# Altium project remoteV1.2.PrjPcb
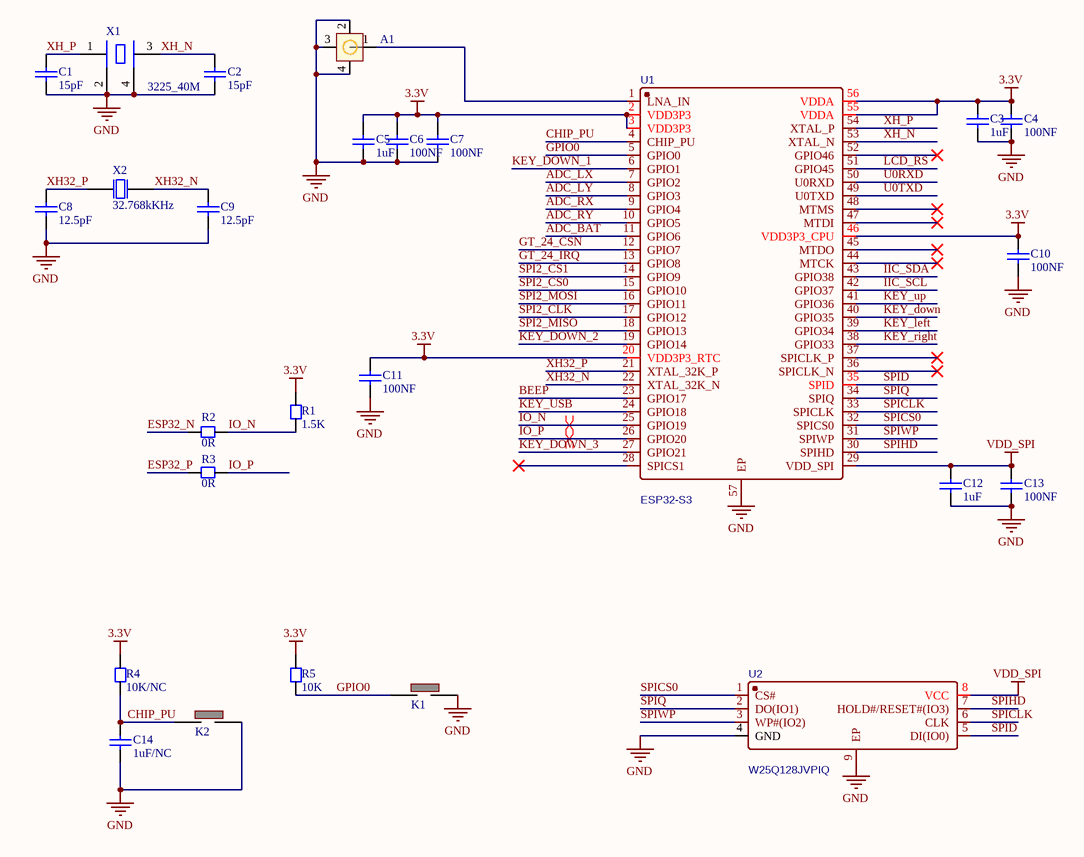
[diagram p0: Sheet0-mcu.SchDoc]
3 sheets, 124 parts. Net scope: global (net labels, ports and power ports of the same name join across sheets).
Board file: PCB.PcbDoc
Sheets:
  Sheet0-mcu.SchDoc
  Sheet1-control.SchDoc
  Sheet2-USB.SchDoc

## Sheet Sheet0-mcu.SchDoc
size A4; SheetNumber: 1; SheetTotal: 3

### Parts
A1  ANT-IPEX  [IPEX-SMD_HC-RF-IPEX0303-01]  (value not drawn)
C1  15pF  [CC1608-0603]
C2  15pF  [CC1608-0603]
C3  1uF  [CC1608-0603]
C4  100NF  [CC1608-0603]
C5  1uF  [CC1608-0603]
C6  100NF  [CC1608-0603]
C7  100NF  [CC1608-0603]
C8  12.5pF  [CC1608-0603]
C9  12.5pF  [CC1608-0603]
C10  100NF  [CC1608-0603]
C11  100NF  [CC1608-0603]
C12  1uF  [CC1608-0603]
C13  100NF  [CC1608-0603]
C14  1uF/NC  [CC1608-0603]
K1  KEY 3*4  [KEY 3*4]  (value not drawn)
K2  KEY 3*4  [KEY 3*4]  (value not drawn)
R1  1.5K  [CR1608-0603]
R2  0R  [CR1608-0603]
R3  0R  [CR1608-0603]
R4  10K/NC  [CR1608-0603]
R5  10K  [CR1608-0603]
U1  ESP32-S3  [QFN-56]
U2  W25Q128JVPIQ  [WSON-8]
X1  3225_40M  [XTAL-3225]
X2  32.768kKHz  [XTAL-3215]

### Nets
3.3V: C3.2 C4.2 C5.2 C6.2 C7.2 C10.2 C11.2 R1.1 R4.2 R5.2 U1.2(VDD3P3) U1.3(VDD3P3) U1.20(VDD3P3_RTC) U1.46(VDD3P3_CPU) U1.55(VDDA) U1.56(VDDA)
GND: A1.2 A1.3 A1.4 C1.1 C2.1 C3.1 C4.1 C5.1 C6.1 C7.1 C8.1 C9.1 C10.1 C11.1 C12.1 C13.1 C14.1 K1.2 K2.2 U1.57(EP) U2.4(GND) U2.9(EP) X1.2(GND) X1.4(GND)
VDD_SPI: C12.2 C13.2 U1.29(VDD_SPI) U2.8(VCC)
ADC_BAT: U1.11(GPIO6)
ADC_LX: U1.7(GPIO2)
ADC_LY: U1.8(GPIO3)
ADC_RX: U1.9(GPIO4)
ADC_RY: U1.10(GPIO5)
BEEP: U1.23(GPIO17)
CHIP_PU: C14.2 K2.1 R4.1 U1.4(CHIP_PU)
ESP32_N: R2.2
ESP32_P: R3.2
GPIO0: K1.1 R5.1 U1.5(GPIO0)
GT_24_CSN: U1.12(GPIO7)
GT_24_IRQ: U1.13(GPIO8)
IIC_SCL: U1.42(GPIO37)
IIC_SDA: U1.43(GPIO38)
IO_N: R1.2 R2.1 U1.25(GPIO19)
IO_P: R3.1 U1.26(GPIO20)
KEY_down: U1.40(GPIO35)  [project net KEY_b]
KEY_DOWN_1: U1.6(GPIO1)
KEY_DOWN_2: U1.19(GPIO14)
KEY_DOWN_3: U1.27(GPIO21)
KEY_left: U1.39(GPIO34)
KEY_right: U1.38(GPIO33)  [project net KET_y]
KEY_up: U1.41(GPIO36)  [project net KEY_a]
KEY_USB: U1.24(GPIO18)
LCD_RS: U1.51(GPIO45)
SPI2_CLK: U1.17(GPIO12)
SPI2_CS0: U1.15(GPIO10)
SPI2_CS1: U1.14(GPIO9)
SPI2_MISO: U1.18(GPIO13)
SPI2_MOSI: U1.16(GPIO11)
SPICLK: U1.33(SPICLK) U2.6(CLK)
SPICS0: U1.32(SPICS0) U2.1(CS#)
SPID: U1.35(SPID) U2.5(DI(IO0))
SPIHD: U1.30(SPIHD) U2.7(HOLD#/RESET#(IO3))
SPIQ: U1.34(SPIQ) U2.2(DO(IO1))
SPIWP: U1.31(SPIWP) U2.3(WP#(IO2))
U0RXD: U1.50(U0RXD)
U0TXD: U1.49(U0TXD)
XH32_N: C9.2 U1.22(XTAL_32K_N) X2.2(OSC2)
XH32_P: C8.2 U1.21(XTAL_32K_P) X2.1(OSC1)
XH_N: C2.2 U1.53(XTAL_N) X1.3(OSC2)
XH_P: C1.2 U1.54(XTAL_P) X1.1(OSC1)
NetA1_1: A1.1 U1.1(LNA_IN)

Not connected (* = marked no-connect by the designer): U1 28(SPICS1)* 36(SPICLK_N)* 37(SPICLK_P)* 44(MTCK)* 45(MTDO)* 47(MTDI)* 48(MTMS)* 52(GPIO46)*

### Layout directives
differential pair: IO_N, IO_P

### Library data of the parts
A1 = ANT-IPEX: 贴片封装的天线 封装类型为IPEX
C1-C14 = Cap Chip 0603: 0603封装的电容; Published: 8-Jun-2000; Revision: July-2002: Re-released for DXP Platform.; Publisher: Altium Limited
K1 K2 = KEY 3*4: 轻触开关按键
R1-R5 = Resistor Chip 0603: 0603封装电阻; Published: 8-Jun-2000; Revision: July-2002: Re-released for DXP Platform.; Publisher: Altium Limited
U1 = ESP32-S3: Manufacturer: ESPRESSIF(乐鑫); Contributor: LCSC; Supplier: LCSC; Supplier Part: C2913192; Manufacturer Part: ESP32-S3; JLCPCB Part Class: Extended Part; spicePre: U; spiceSymbolName: ESP32-S3
U2 = W25Q128JVPIQ: Manufacturer: WINBOND(华邦); Contributor: LCSC; Supplier: LCSC; Supplier Part: C2803379; Manufacturer Part: W25Q128JVPIQ; JLCPCB Part Class: Extended Part; spicePre: U; spiceSymbolName: W25Q128JVPIQ
X1 = XTAL 3225: 3225封装的晶振
X2 = XTAL 3215 32.768kKHz: 3215封装的时钟晶振

## Sheet Sheet1-control.SchDoc
size A3; SheetNumber: 2; SheetTotal: 3
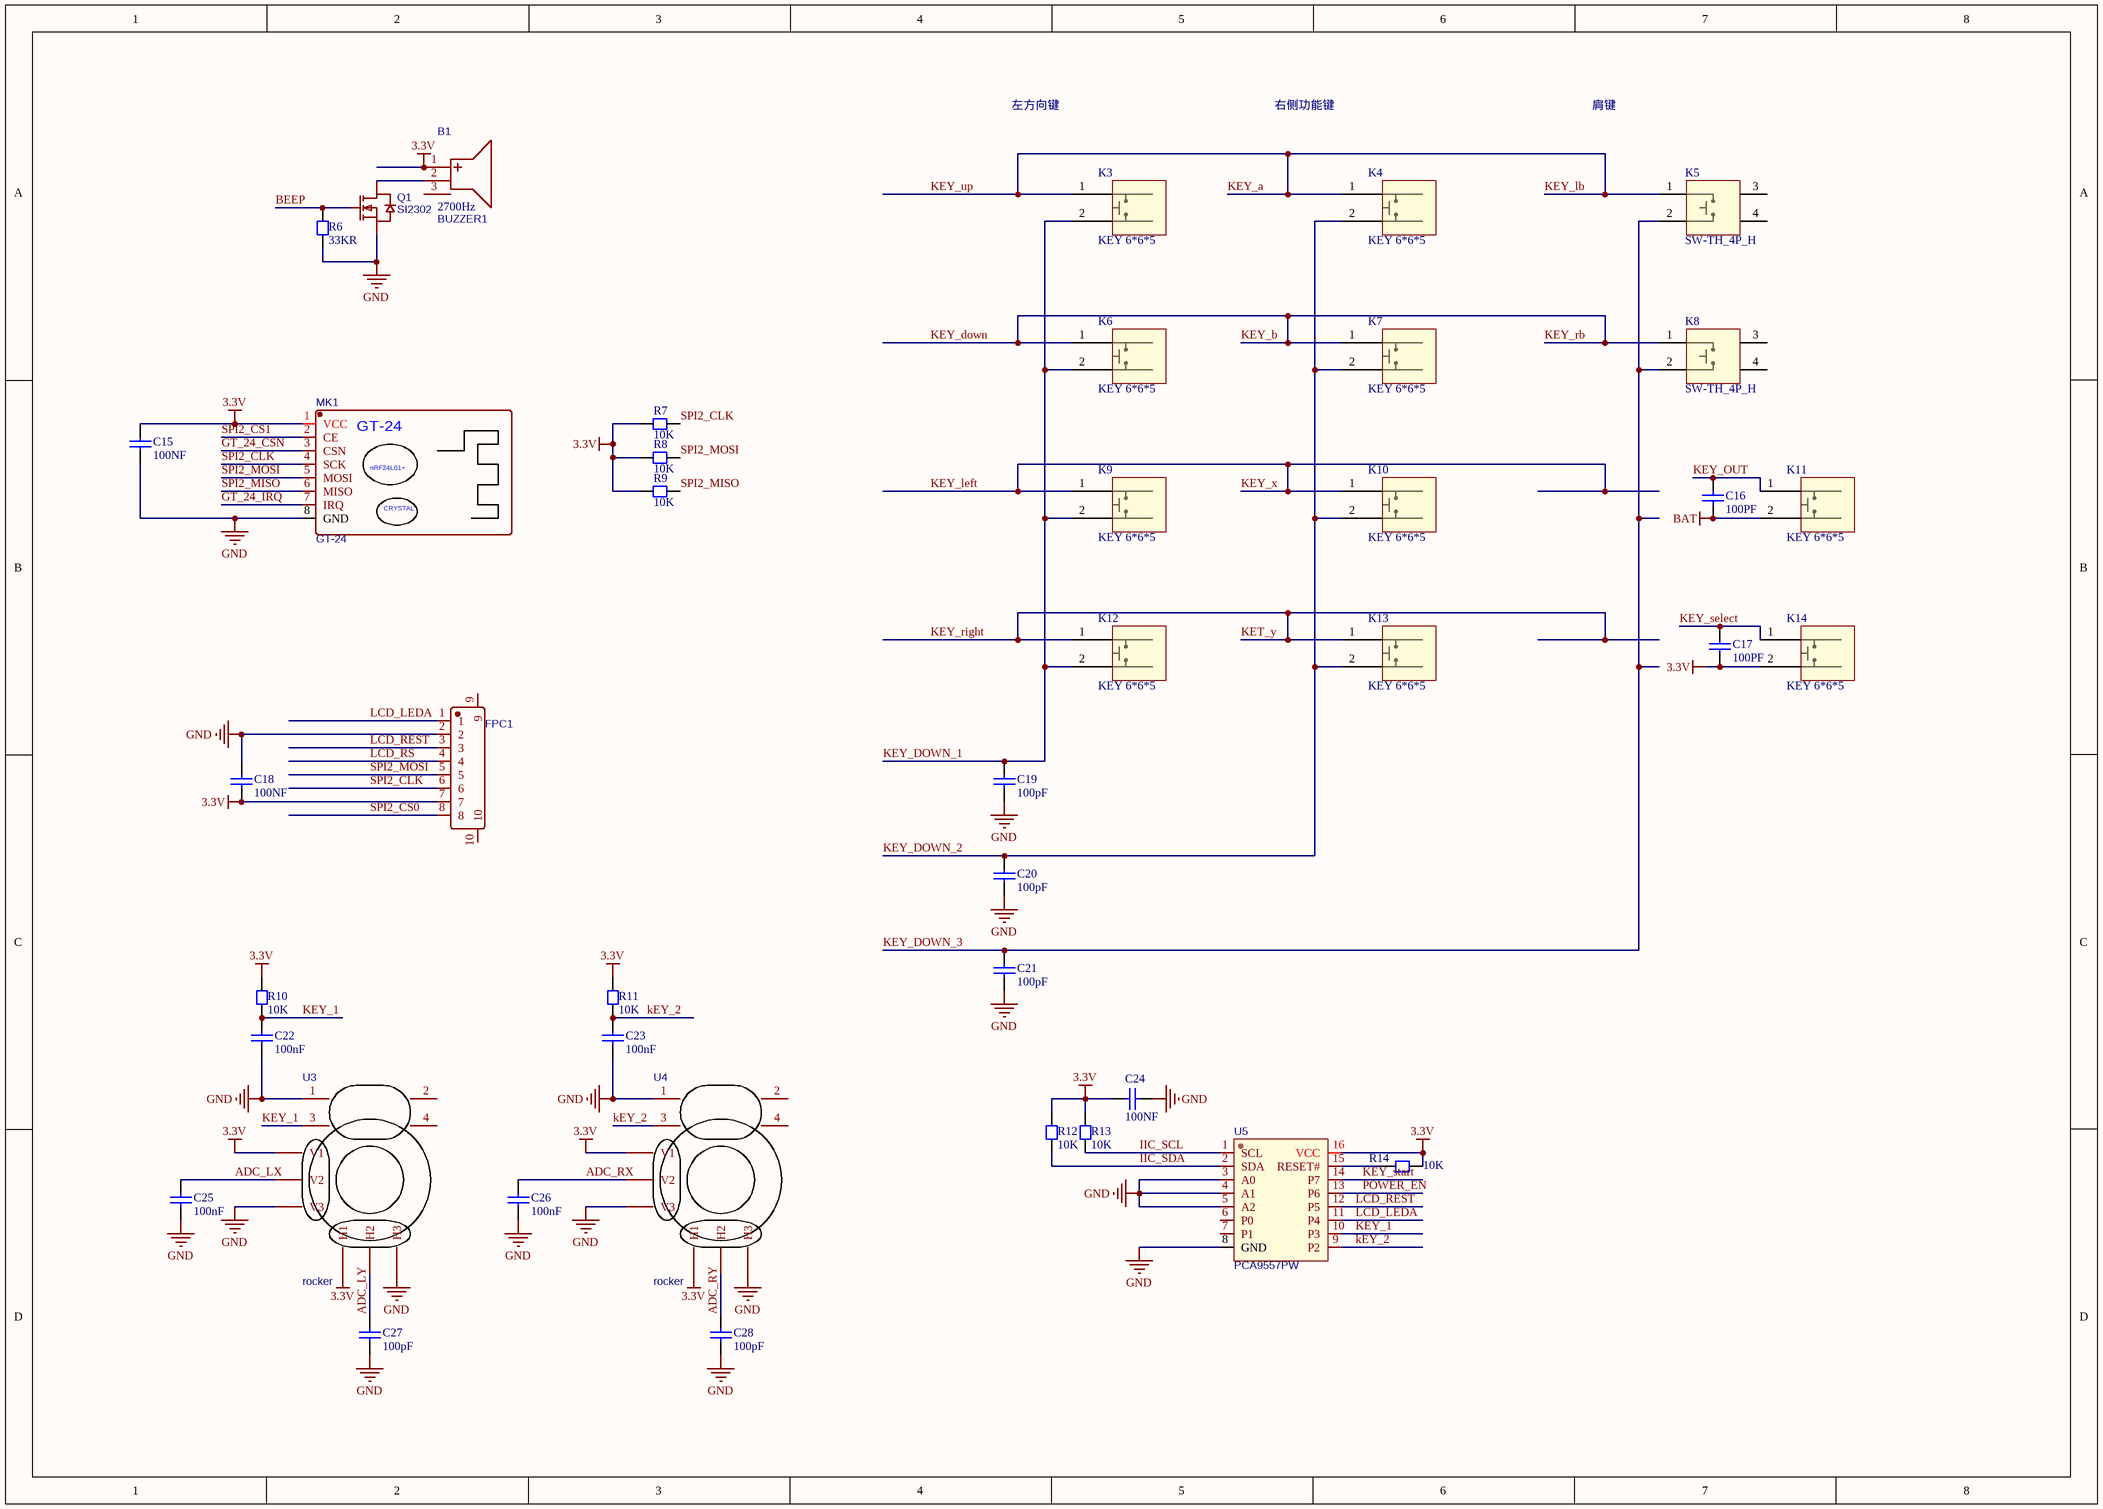
[diagram p1: Sheet1-control.SchDoc]

### Parts
B1  BUZZER1  [BUZ-SMD_GSC7525RA]
C15  100NF  [CC1608-0603]
C16  100PF  [CC1608-0603]
C17  100PF  [CC1608-0603]
C18  100NF  [CC1608-0603]
C19  100pF  [CC1608-0603]
C20  100pF  [CC1608-0603]
C21  100pF  [CC1608-0603]
C22  100nF  [CC1608-0603]
C23  100nF  [CC1608-0603]
C24  100NF  [CC1608-0603]
C25  100nF  [CC1608-0603]
C26  100nF  [CC1608-0603]
C27  100pF  [CC1608-0603]
C28  100pF  [CC1608-0603]
FPC1  FFC 05 8P  [FFC-SMD_8P-P0.50]  (value not drawn)
K3  KEY 6*6*5  [KEY 6*6*5]
K4  KEY 6*6*5  [KEY 6*6*5]
K5  SW-TH_4P_H  [SW-TH_KH-6X6X7H-ZJ]
K6  KEY 6*6*5  [KEY 6*6*5]
K7  KEY 6*6*5  [KEY 6*6*5]
K8  SW-TH_4P_H  [SW-TH_KH-6X6X7H-ZJ]
K9  KEY 6*6*5  [KEY 6*6*5]
K10  KEY 6*6*5  [KEY 6*6*5]
K11  KEY 6*6*5  [KEY 6*6*5]
K12  KEY 6*6*5  [KEY 6*6*5]
K13  KEY 6*6*5  [KEY 6*6*5]
K14  KEY 6*6*5  [KEY 6*6*5]
MK1  GT-24  [WIRELM-SMD_AS01-ML01S]
Q1  SI2302  [SOT-23]
R6  33KR  [CR1608-0603]
R7  10K  [CR1608-0603]
R8  10K  [CR1608-0603]
R9  10K  [CR1608-0603]
R10  10K  [CR1608-0603]
R11  10K  [CR1608-0603]
R12  10K  [CR1608-0603]
R13  10K  [CR1608-0603]
R14  10K  [CR1608-0603]
U3  rocker  [PCBComponent_1]
U4  rocker  [PCBComponent_1]
U5  PCA9557PW  [TSSOP-16]

### Nets
3.3V: B1.1(+) C15.2 C17.2 C18.1 C24.2 FPC1.7 K14.2 MK1.1(VCC) R7.2 R8.2 R9.2 R10.2 R11.2 R12.1 R13.1 R14.1 U3.5(V1) U3.8(H1) U4.5(V1) U4.8(H1) U5.16(VCC)
BAT: C16.2 K11.2
GND: C15.1 C18.2 C19.1 C20.1 C21.1 C22.1 C23.1 C24.1 C25.1 C26.1 C27.1 C28.1 FPC1.2 MK1.8(GND) Q1.2(S) R6.2 U3.1 U3.7(V3) U3.10(H3) U4.1 U4.7(V3) U4.10(H3) U5.3(A0) U5.4(A1) U5.5(A2) U5.8(GND)
ADC_LX: C25.2 U3.6(V2)
ADC_LY: C27.2 U3.9(H2)
ADC_RX: C26.2 U4.6(V2)
ADC_RY: C28.2 U4.9(H2)
BEEP: Q1.1(G) R6.1
GT_24_CSN: MK1.3(CSN)
GT_24_IRQ: MK1.7(IRQ)
IIC_SCL: R13.2 U5.1(SCL)
IIC_SDA: R12.2 U5.2(SDA)
KET_y: K12.1 K13.1  [also labelled KEY_right]
KEY_1: C22.2 R10.1 U3.3 U5.10(P3)
kEY_2: C23.2 R11.1 U4.3 U5.9(P2)
KEY_a: K3.1 K4.1 K5.1  [also labelled KEY_lb, KEY_up]
KEY_b: K6.1 K7.1 K8.1  [also labelled KEY_down, KEY_rb]
KEY_DOWN_1: C19.2 K3.2 K6.2 K9.2 K12.2
KEY_DOWN_2: C20.2 K4.2 K7.2 K10.2 K13.2
KEY_DOWN_3: C21.2 K5.2 K8.2
KEY_left: K9.1 K10.1  [also labelled KEY_x]
KEY_OUT: C16.1 K11.1
KEY_select: C17.1 K14.1
KEY_start: U5.14(P7)
LCD_LEDA: FPC1.1 U5.11(P4)
LCD_REST: FPC1.3 U5.12(P5)
LCD_RS: FPC1.4
POWER_EN: U5.13(P6)
SPI2_CLK: FPC1.6 MK1.4(SCK) R7.1
SPI2_CS0: FPC1.8
SPI2_CS1: MK1.2(CE)
SPI2_MISO: MK1.6(MISO) R9.1
SPI2_MOSI: FPC1.5 MK1.5(MOSI) R8.1
NetB1_2: B1.2(-) Q1.3(D)
NetR14_2: R14.2 U5.15(RESET#)

Not connected (* = marked no-connect by the designer): B1 3(EH); FPC1 9 10; K5 3 4; K8 3 4; U3 2 4; U4 2 4; U5 6(P0) 7(P1)

### Notes on the sheet
- 左方向键
- 右侧功能键
- 肩键
- (in symbol GT-24) nRF24L01+; CRYSTAL

### Library data of the parts
B1 = BUZZER1: 2700Hz; Manufacturer: INGHAi(赢海); Manufacturer Part: GSC7525RA-16R2700; Contributor: LCSC; nameAlias: Value; Supplier: LCSC; Supplier Part: C255313; spicePre: B; spiceSymbolName: GSC7525RA-16R2700
C15-C28 = Cap Chip 0603: 0603封装的电容; Published: 8-Jun-2000; Revision: July-2002: Re-released for DXP Platform.; Publisher: Altium Limited
FPC1 = FFC 05 8P: Manufacturer: TXGA(特思嘉); Manufacturer Part: FFC05001-08SBB124W5M-H; Contributor: LCSC; Supplier: LCSC; Supplier Part: C456420; JLCPCB Part Class: Extended Part; spicePre: F; spiceSymbolName: FFC05001-08SBB124W5M-H
K3 K4 K6 K7 K9-K14 = KEY 6*6*5: 无声轻触开关
K5 K8 = SW-TH_4P_H: 卧式轻触开关
MK1 = GT-24: 工业级GT-24数传无线模块 2.4G NRF24L01&PA+LNA; Manufacturer: Ashining(泽耀科技); Manufacturer Part: AS01-ML01S; Supplier: LCSC; Supplier Part: C84802; JLCPCB Part Class: Extended Part; spicePre: M; spiceSymbolName: AS01-ML01S
Q1 = SI2302: N沟道 / 漏源电压(Vdss) 20V / 连续漏极电流(Id) 2.8A / 功率(Pd) 900mW / 导通电阻(RDS(on)@Vgs,Id) 55mΩ@4.5V,2.8A / 阈值电压(Vgs(th)@Id) 1.2V@250uA / 输入电容(Ciss@Vds) 260pF@10V; Manufacturer: TWGMC(台湾迪嘉); Manufacturer Part: SI2306; Contributor: LCSC; Supplier: LCSC; Supplier Part: C727154; JLCPCB Part Class: Extended Part; spicePre: Q; spiceSymbolName: SI2306_C727154
R6 = Chip resistor: 贴片电阻
R7-R14 = Resistor Chip 0603: 0603封装电阻; Published: 8-Jun-2000; Revision: July-2002: Re-released for DXP Platform.; Publisher: Altium Limited
U3 U4 = rocker: Manufacturer Part: 摇杆; Contributor: Alex_Ai; spicePre: U; spiceSymbolName: 摇杆_直插_圆半径13_10电气脚_4固定脚 COPY
U5 = PCA9557PW: TSSOP-16 8位I2C总线和SMBus I/O扩展器芯片; Manufacturer: TI(德州仪器); Contributor: LCSC; Supplier: LCSC; Supplier Part: C1542488; Manufacturer Part: PCA9557PW; JLCPCB Part Class: Extended Part; spicePre: U; spiceSymbolName: PCA9557PW

## Sheet Sheet2-USB.SchDoc
size A3; SheetNumber: 3; SheetTotal: 3
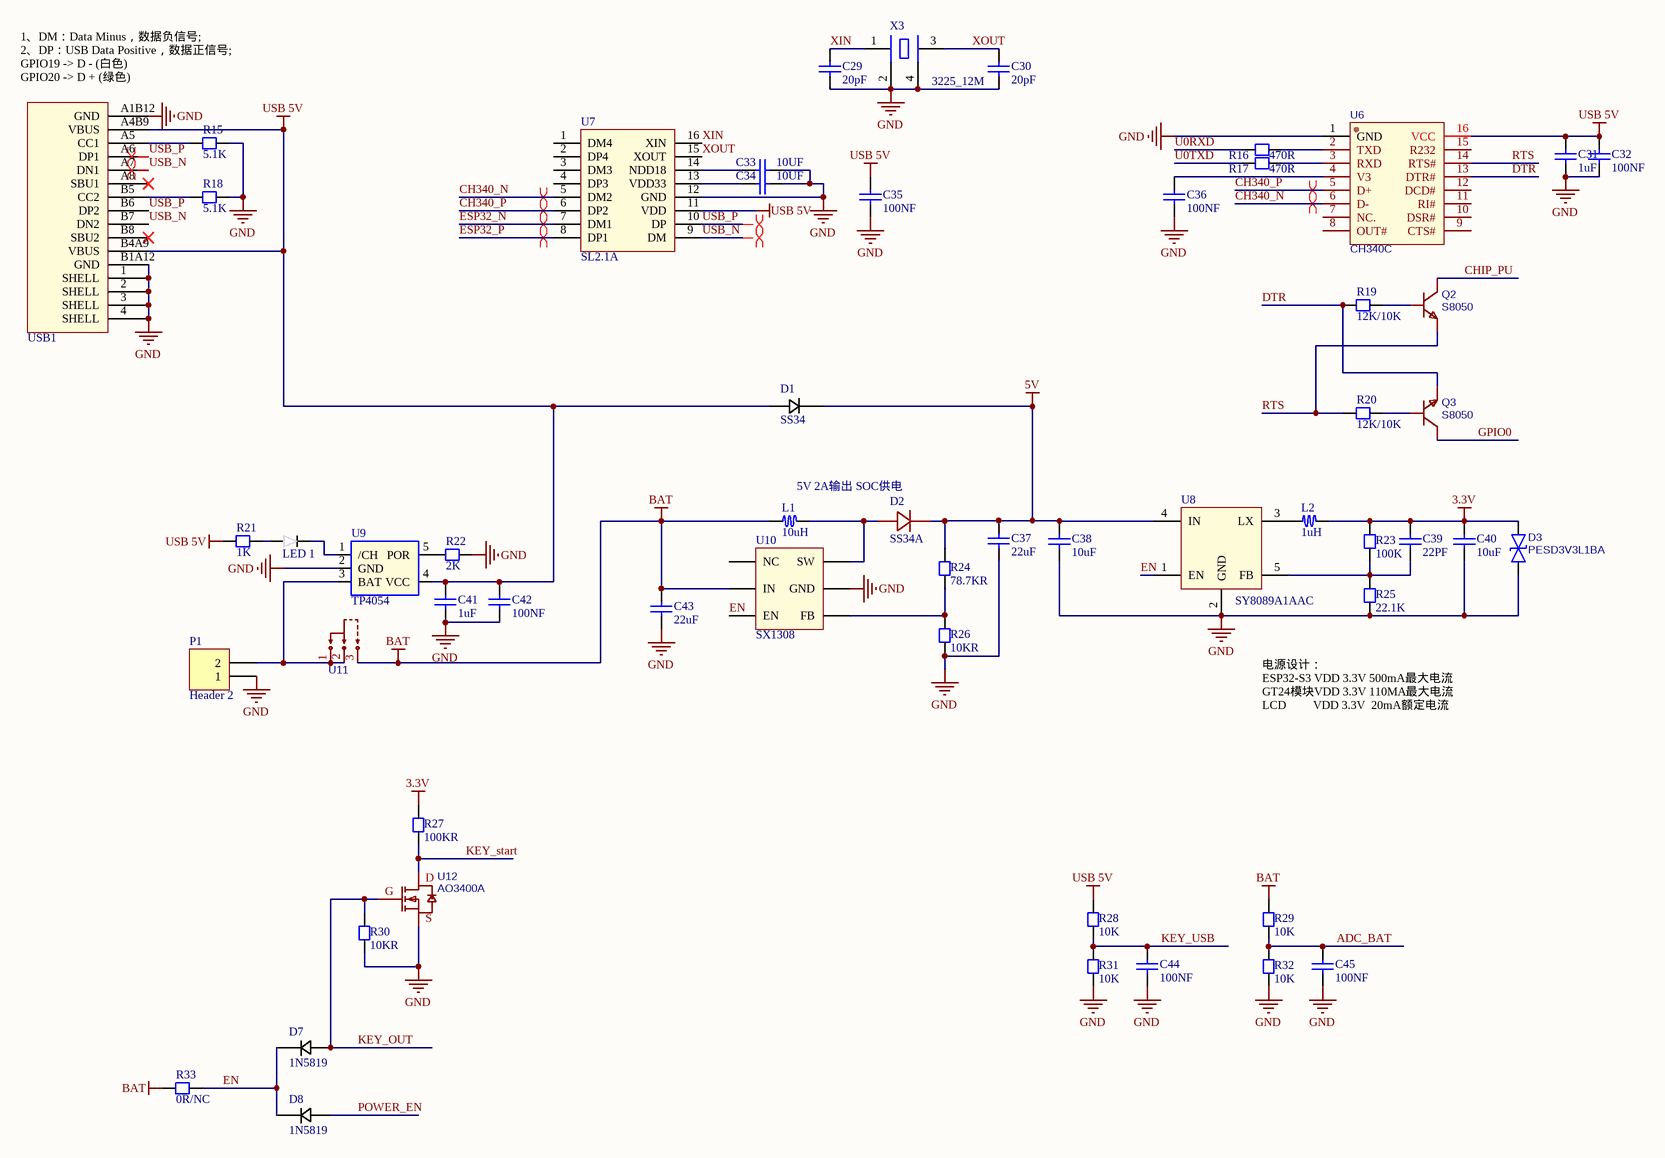
[diagram p2: Sheet2-USB.SchDoc]

### Parts
C29  20pF  [CC1608-0603]
C30  20pF  [CC1608-0603]
C31  1uF  [CC1608-0603]
C32  100NF  [CC1608-0603]
C33  10UF  [CC1608-0603]
C34  10UF  [CC1608-0603]
C35  100NF  [CC1608-0603]
C36  100NF  [CC1608-0603]
C37  22uF  [CC1608-0603]
C38  10uF  [CC1608-0603]
C39  22PF  [CC1608-0603]
C40  10uF  [CC1608-0603]
C41  1uF  [CC1608-0603]
C42  100NF  [CC1608-0603]
C43  22uF  [CC1608-0603]
C44  100NF  [CC1608-0603]
C45  100NF  [CC1608-0603]
D1  SS34  [DO-214 AA]
D2  SS34A  [DO-214 AA SMB]
D3  PESD3V3L1BA  [SOD-323]
D7  1N5819  [SOD-323_L1.8-W1.3-LS2.5-RD]
D8  1N5819  [SOD-323_L1.8-W1.3-LS2.5-RD]
L1  10uH  [Inductor-6045]
L2  1uH  [Inductor-4018]
LED_1  LED 0603  [LED 0603]  (value not drawn)
P1  Header 2  [HX2.54-2]
Q2  S8050  [SOT-23]
Q3  S8050  [SOT-23]
R15  5.1K  [CR1608-0603]
R16  470R  [CR1608-0603]
R17  470R  [CR1608-0603]
R18  5.1K  [CR1608-0603]
R19  12K/10K  [CR1608-0603]
R20  12K/10K  [CR1608-0603]
R21  1K  [CR1608-0603]
R22  2K  [CR1608-0603]
R23  100K  [CR1608-0603]
R24  78.7KR  [CR1608-0603]
R25  22.1K  [CR1608-0603]
R26  10KR  [CR1608-0603]
R27  100KR  [CR1608-0603]
R28  10K  [CR1608-0603]
R29  10K  [CR1608-0603]
R30  10KR  [CR1608-0603]
R31  10K  [CR1608-0603]
R32  10K  [CR1608-0603]
R33  0R/NC  [CR1608-0603]
U6  CH340C  [SOP-16]
U7  SL2.1A  [SOP-16]
U8  SY8089A1AAC  [SOT23-5]
U9  TP4054  [SOT23-5]
U10  SX1308  [SOT23-6]
U11  HX SS12D10G4  [SW-TH_3P-SS12D06]  (value not drawn)
U12  AO3400A  [SOT-23]
USB1  Tpye-c 16P  [TYPE-C 16P]  (value not drawn)
X3  3225_12M  [XTAL-3225]

### Nets
3.3V: C39.2 C40.2 D3.1 L2.2 R23.1 R27.2
5V: C37.1 C38.2 D1.1(K) D2.1(C) R24.2 U8.4(IN)
BAT: C43.2 L1.1 R29.2 R33.1 U10.5(IN) U11.3
GND: C29.1 C30.1 C31.1 C32.1 C33.1 C34.1 C35.1 C36.1 C37.2 C38.1 C40.1 C41.1 C42.1 C43.1 C44.1 C45.1 D3.2 P1.1 R15.1 R18.1 R22.2 R25.2 R26.1 R30.1 R31.1 R32.1 U6.1(GND) U7.12(GND) U8.2(GND) U9.2(GND) U10.2(GND) U12.2(S) USB1.1(SHELL) USB1.2(SHELL) USB1.3(SHELL) USB1.4(SHELL) USB1.A1B12(GND) USB1.B1A12(GND) X3.2(GND) X3.4(GND)
USB 5V: C31.2 C32.2 C35.2 C41.2 C42.2 D1.2(A) R21.1 R28.2 U6.16(VCC) U7.11(VDD) U9.4(VCC) USB1.A4B9(VBUS) USB1.B4A9(VBUS)
ADC_BAT: C45.2 R29.1 R32.2
CH340_N: U6.6(D-) U7.5(DM2)
CH340_P: U6.5(D+) U7.6(DP2)
CHIP_PU: Q2.3(C)
DTR: Q3.2(E) R19.1 U6.13(DTR#)
EN: D7.1 D8.1 R33.2 U8.1(EN) U10.4(EN)
ESP32_N: U7.7(DM1)
ESP32_P: U7.8(DP1)
GPIO0: Q3.3(C)
KEY_OUT: D7.2 R30.2 U12.1(G)
KEY_start: R27.1 U12.3(D)
KEY_USB: C44.2 R28.1 R31.2
POWER_EN: D8.2
RTS: Q2.2(E) R20.1 U6.14(RTS#)
U0RXD: R16.2
U0TXD: R17.2
USB_N: U7.9(DM) USB1.A7(DN1) USB1.B7(DN2)
USB_P: U7.10(DP) USB1.A6(DP1) USB1.B6(DP2)
XIN: C29.2 U7.16(XIN) X3.1(OSC1)
XOUT: C30.2 U7.15(XOUT) X3.3(OSC2)
NetC33_2: C33.2 U7.14(NDD18)
NetC34_2: C34.2 U7.13(VDD33)
NetC36_2: C36.2 U6.4(V3)
NetC39_1: C39.1 R23.2 R25.1 U8.5(FB)
NetD2_2: D2.2(A) L1.2 U10.1(SW)
NetL2_1: L2.1 U8.3(LX)
NetLED_1_1: LED_1.1 R21.2
NetLED_1_2: LED_1.2 U9.1(/CH)
NetP1_2: P1.2 U9.3(BAT) U11.1 U11.2
NetQ2_1: Q2.1(B) R19.2
NetQ3_1: Q3.1(B) R20.2
NetR15_2: R15.2 USB1.A5(CC1)
NetR16_1: R16.1 U6.2(TXD)
NetR17_1: R17.1 U6.3(RXD)
NetR18_2: R18.2 USB1.B5(CC2)
NetR22_1: R22.1 U9.5(POR)
NetR24_1: R24.1 R26.2 U10.3(FB)

Not connected (* = marked no-connect by the designer): U6 7(NC.) 8(OUT#) 9(CTS#) 10(DSR#) 11(RI#) 12(DCD#) 15(R232); U7 1(DM4) 2(DP4) 3(DM3) 4(DP3); U10 6(NC); USB1 A8(SBU1)* B8(SBU2)*

### Layout directives
differential pair: CH340_N, CH340_P, ESP32_N, ESP32_P, USB_N, USB_P

### Notes on the sheet
- (near USB1) 1、DM：Data Minus，数据负信号;
  2、DP：USB Data Positive，数据正信号;
  GPIO19 -> D - (白色)
  GPIO20 -> D + (绿色)
- 5V 2A输出 SOC供电
- 电源设计：
  ESP32-S3 VDD 3.3V 500mA最大电流
  GT24模块VDD 3.3V 110MA最大电流
  LCD         VDD 3.3V  20mA额定电流

### Library data of the parts
C29-C36 C38-C45 = Cap Chip 0603: 0603封装的电容; Published: 8-Jun-2000; Revision: July-2002: Re-released for DXP Platform.; Publisher: Altium Limited
C37 = Chip capacitor: 贴片电容
D1 = SS34: 肖特基二极管
D2 = SS34A: 大电流肖特基二极管，5A/40V
D3 = PESD3V3L1BA: SOD-323 3.3V 双向ESD防静电二极管保护芯片; Manufacturer: MDD; Manufacturer Part: SMAJ6.5CA; Supplier: LCSC; Supplier Part: C110041; JLCPCB Part Class: Extended Part; spicePre: D; spiceSymbolName: SMAJ6.5CA-C110041
D7 D8 = 1N5819: 肖特基二极管
L1 = Inductor-6045: 6045封装 线绕SMD功率电感
L2 = Inductor-4018: 贴片电感 1206封装
P1 = Header 2: Header, 2-Pin; LatestRevisionDate: 17-Jul-2002; LatestRevisionNote: Re-released for DXP Platform.; Publisher: Altium Limited
Q2 Q3 = S8050: Manufacturer: SALLTECH(萨瑞); Contributor: lcsc; Supplier: LCSC; Supplier Part: C3027096; Manufacturer Part: S8050; spicePre: Q; spiceSymbolName: S8050_C3027096
R15-R23 R25 R28 R29 R31-R33 = Resistor Chip 0603: 0603封装电阻; Published: 8-Jun-2000; Revision: July-2002: Re-released for DXP Platform.; Publisher: Altium Limited
R24 R26 R27 R30 = Chip resistor: 贴片电阻
U6 = CH340C: Manufacturer: WCH(南京沁恒); Supplier: LCSC; Manufacturer Part: CH340C; Supplier Part: C84681; JLCPCB Part Class: Extended Part; spicePre: U; spiceSymbolName: CH340C
U7 = SL2.1A: USB HUB 四拓展
U8 = SY8089A1AAC: SY8089A1是一种高效率的1.5MHz同步降压DC/DC稳压器，能够提供高达输出电流2A。它可以在2.5V到5.5V的宽输入电压范围内工作，集成了主开关和同步开关，具有极低的RDS(ON)，最大限度地减少了导通损耗。 / 输出电压纹波小，外接电感小，电容器尺寸小 / 1.5MHz开关频率。
U9 = TP4054: 迷你充电IC SOT-23-5
U10 = SX1308: SOT23-6 升压芯片
U11 = SW-TH_3P-SS12D06: BOM_Manufacturer: hanxia(韩下); Contributor: lcsc; BOM_Supplier: LCSC; BOM_Supplier Part: C5149841; BOM_Manufacturer Part: HX SS12D10G4; link: https://atta.szlcsc.com/upload/public/pdf/source/20220907/2020D7183ED16DD6E2B9F5A13FB144CF.pdf; BOM_JLCPCB Part Class: Extended Part; spicePre: U; spiceSymbolName: HX SS12D10G4
U12 = AO3400A: UMW AO3400A SOT-23 30V/5.8A N沟道 MOS(场效应管)芯片; Manufacturer: ElecSuper(静芯微）; Manufacturer Part: AO3401A; Contributor: lcsc; Supplier: LCSC; Supplier Part: C5224202; JLCPCB Part Class: Extended Part; link: https://so.szlcsc.com/global.html?k=C5224202&ref=editor; spicePre: U; spiceSymbolName: AO3401A_C5224202
USB1 = Tpye-c 16P: 16P 封装的TYPE -c接口 4固定插脚 双向
X3 = XTAL 3225: 3225封装的晶振

## Nets that join several sheets
3.3V: Sheet0-mcu (16 pins), Sheet1-control (21 pins), Sheet2-USB (6 pins)
BAT: Sheet1-control (C16.2 K11.2), Sheet2-USB (6 pins)
GND: Sheet0-mcu (24 pins), Sheet1-control (26 pins), Sheet2-USB (40 pins)
ADC_BAT: Sheet0-mcu (U1.11), Sheet2-USB (C45.2 R29.1 R32.2)
ADC_LX: Sheet0-mcu (U1.7), Sheet1-control (C25.2 U3.6)
ADC_LY: Sheet0-mcu (U1.8), Sheet1-control (C27.2 U3.9)
ADC_RX: Sheet0-mcu (U1.9), Sheet1-control (C26.2 U4.6)
ADC_RY: Sheet0-mcu (U1.10), Sheet1-control (C28.2 U4.9)
BEEP: Sheet0-mcu (U1.23), Sheet1-control (Q1.1 R6.1)
CHIP_PU: Sheet0-mcu (C14.2 K2.1 R4.1 U1.4), Sheet2-USB (Q2.3)
ESP32_N: Sheet0-mcu (R2.2), Sheet2-USB (U7.7)
ESP32_P: Sheet0-mcu (R3.2), Sheet2-USB (U7.8)
GPIO0: Sheet0-mcu (K1.1 R5.1 U1.5), Sheet2-USB (Q3.3)
GT_24_CSN: Sheet0-mcu (U1.12), Sheet1-control (MK1.3)
GT_24_IRQ: Sheet0-mcu (U1.13), Sheet1-control (MK1.7)
IIC_SCL: Sheet0-mcu (U1.42), Sheet1-control (R13.2 U5.1)
IIC_SDA: Sheet0-mcu (U1.43), Sheet1-control (R12.2 U5.2)
KET_y: Sheet0-mcu (U1.38), Sheet1-control (K12.1 K13.1)
KEY_a: Sheet0-mcu (U1.41), Sheet1-control (K3.1 K4.1 K5.1)
KEY_b: Sheet0-mcu (U1.40), Sheet1-control (K6.1 K7.1 K8.1)
KEY_DOWN_1: Sheet0-mcu (U1.6), Sheet1-control (5 pins)
KEY_DOWN_2: Sheet0-mcu (U1.19), Sheet1-control (5 pins)
KEY_DOWN_3: Sheet0-mcu (U1.27), Sheet1-control (C21.2 K5.2 K8.2)
KEY_left: Sheet0-mcu (U1.39), Sheet1-control (K9.1 K10.1)
KEY_OUT: Sheet1-control (C16.1 K11.1), Sheet2-USB (D7.2 R30.2 U12.1)
KEY_start: Sheet1-control (U5.14), Sheet2-USB (R27.1 U12.3)
KEY_USB: Sheet0-mcu (U1.24), Sheet2-USB (C44.2 R28.1 R31.2)
LCD_RS: Sheet0-mcu (U1.51), Sheet1-control (FPC1.4)
POWER_EN: Sheet1-control (U5.13), Sheet2-USB (D8.2)
SPI2_CLK: Sheet0-mcu (U1.17), Sheet1-control (FPC1.6 MK1.4 R7.1)
SPI2_CS0: Sheet0-mcu (U1.15), Sheet1-control (FPC1.8)
SPI2_CS1: Sheet0-mcu (U1.14), Sheet1-control (MK1.2)
SPI2_MISO: Sheet0-mcu (U1.18), Sheet1-control (MK1.6 R9.1)
SPI2_MOSI: Sheet0-mcu (U1.16), Sheet1-control (FPC1.5 MK1.5 R8.1)
U0RXD: Sheet0-mcu (U1.50), Sheet2-USB (R16.2)
U0TXD: Sheet0-mcu (U1.49), Sheet2-USB (R17.2)